# EAGLE design sensor_dsp (EAGLE 7.6.0)
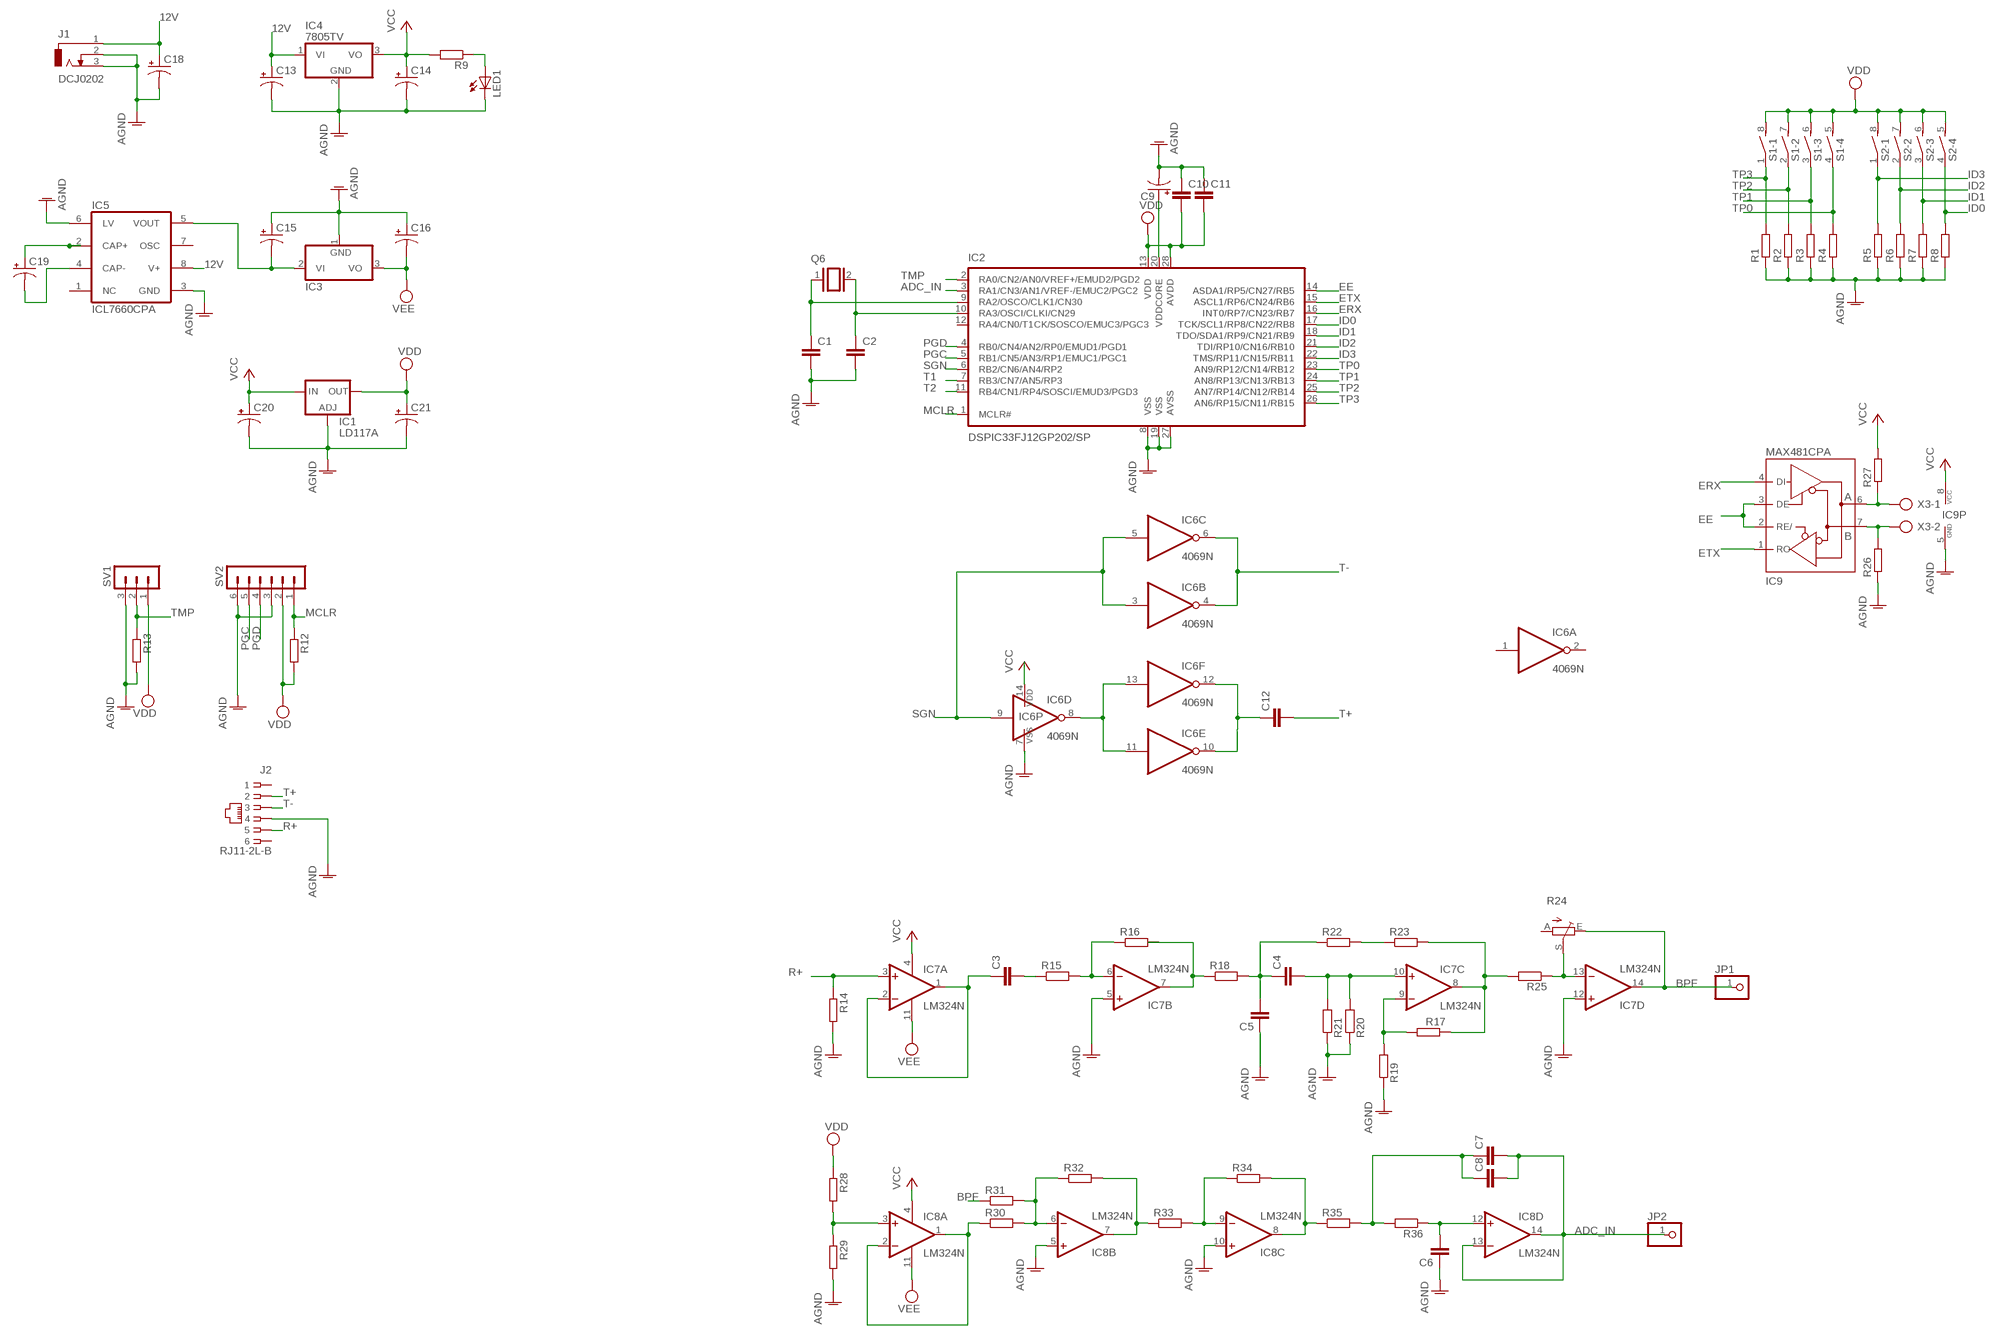
[diagram p0: schematic, sheet 1]

## Parts
C1  C2.5/2  [C2.5-2]
C2  C2.5/2  [C2.5-2]
C3  C2.5/2  [C2.5-2]
C4  C2.5/2  [C2.5-2]
C5  C-EU050-024X044  [C050-024X044]
C6  C-EU050-024X044  [C050-024X044]
C7  C2.5/2  [C2.5-2]
C8  C2.5/2  [C2.5-2]
C9  CPOL-USE3.5-8  [E3,5-8]
C10  C2.5/2  [C2.5-2]
C11  C2.5/2  [C2.5-2]
C12  C-EU050-024X044  [C050-024X044]
C13  CPOL-USE3.5-8  [E3,5-8]
C14  CPOL-USE3.5-8  [E3,5-8]
C15  CPOL-USE3.5-8  [E3,5-8]
C16  CPOL-USE3.5-8  [E3,5-8]
C18  CPOL-USE3.5-8  [E3,5-8]
C19  CPOL-USE3.5-8  [E3,5-8]
C20  CPOL-USE3.5-8  [E3,5-8]
C21  CPOL-USE3.5-8  [E3,5-8]
IC1  LD117A  [TO220S]
IC2  DSPIC33FJ12GP202/SP  [DIL28-3]
IC3  79  [TO220V]
IC4  7805TV  [TO220V]
IC5  ICL7660CPA  [DIL08]
IC6  4069N  [DIL14]
IC7  LM324N  [DIL14]
IC8  LM324N  [DIL14]
IC9  MAX481CPA  [DIL08]
J1  DCJ0202  [DCJ0202]
J2  RJ11-2L-B  [RJ11-NO_SHIELD]
JP1  PINHD-1X1  [1X01]
JP2  PINHD-1X1  [1X01]
LED1  LED3MM  [LED3MM]
Q6  XTAL/S  [QS]
R1  R-EU_0204/5  [0204/5]
R2  R-EU_0204/5  [0204/5]
R3  R-EU_0204/5  [0204/5]
R4  R-EU_0204/5  [0204/5]
R5  R-EU_0204/5  [0204/5]
R6  R-EU_0204/5  [0204/5]
R7  R-EU_0204/5  [0204/5]
R8  R-EU_0204/5  [0204/5]
R9  R-EU_0204/2V  [0204V]
R12  R-EU_0204/2V  [0204V]
R13  R-EU_0204/2V  [0204V]
R14  R-EU_0204/7  [0204/7]
R15  R-EU_0204/5  [0204/5]
R16  R-EU_0204/2V  [0204V]
R17  R-EU_0204/5  [0204/5]
R18  R-EU_0204/7  [0204/7]
R19  R-EU_0204/5  [0204/5]
R20  R-EU_0204/5  [0204/5]
R21  R-EU_0204/5  [0204/5]
R22  R-EU_0204/5  [0204/5]
R23  R-EU_0204/5  [0204/5]
R24  TRIM_EU-B64W  [B64W]
R25  R-EU_0204/5  [0204/5]
R26  R-EU_0204/5  [0204/5]
R27  R-EU_0204/5  [0204/5]
R28  R-EU_0204/5  [0204/5]
R29  R-EU_0204/5  [0204/5]
R30  R-EU_0204/7  [0204/7]
R31  R-EU_0204/7  [0204/7]
R32  R-EU_0204/2V  [0204V]
R33  R-EU_0204/7  [0204/7]
R34  R-EU_0204/2V  [0204V]
R35  R-EU_0204/7  [0204/7]
R36  R-EU_0204/5  [0204/5]
S1  DIP04S  [DIP04S]
S2  DIP04S  [DIP04S]
SV1  MA03-1  [MA03-1]
SV2  MA06-1  [MA06-1]
X3  AK300/2  [AK300/2]

## Nets
12V: C13.+ C18.+ IC4.1(VI) IC5.8(V+) J1.1
A: IC9.6(A) R27.1 X3.1
ADC_IN: C7.2 C8.2 IC2.3(RA1/CN3/AN1/VREF-/EMUC2/PGC2) IC8.13(D:-IN) IC8.14(D:OUT) JP2.1
AGND: C1.2 C2.2 C5.1 C6.1 C9.- C10.1 C11.1 C13.- C14.- C15.+ C16.+ C18.- C20.- C21.- IC1.1(ADJ) IC2.8(VSS) IC2.19(VSS) IC2.27(AVSS) IC3.1(GND) IC4.2(GND) IC5.3(GND) IC5.6(LV) IC6.7(P:VSS) IC7.5(B:+IN) IC7.12(D:+IN) IC8.5(B:+IN) IC8.10(C:+IN) IC9.5(GND) J1.2 J1.3 J2.4 LED1.K(C) R1.1 R2.1 R3.1 R4.1 R5.1 R6.1 R7.1 R8.1 R13.2 R14.2 R19.1 R20.1 R21.1 R26.1 R29.2 SV1.3 SV2.3 SV2.6
B: IC9.7(B) R26.2 X3.2
BPF: IC7.14(D:OUT) JP1.1 R24.E R31.1
EE: IC2.14(ASDA1/RP5/CN27/RB5) IC9.2(RE/) IC9.3(DE)
ERX: IC2.16(INT0/RP7/CN23/RB7) IC9.4(DI)
ETX: IC2.15(ASCL1/RP6/CN24/RB6) IC9.1(RO)
ID0: IC2.17(TCK/SCL1/RP8/CN22/RB8) R8.2 S2.4
ID1: IC2.18(TDO/SDA1/RP9/CN21/RB9) R7.2 S2.3
ID2: IC2.21(TDI/RP10/CN16/RB10) R6.2 S2.2
ID3: IC2.22(TMS/RP11/CN15/RB11) R5.2 S2.1
MCLR: IC2.1(MCLR#) R12.1 SV2.1
N$1: C9.+ IC2.20(VDDCORE)
N$2: C19.+ IC5.2(CAP+)
N$3: C15.- IC3.2(VI) IC5.5(VOUT)
N$4: C1.1 IC2.9(RA2/OSCO/CLK1/CN30) Q6.1
N$5: C19.- IC5.4(CAP-)
N$6: LED1.A R9.1
N$7: C3.1 IC7.1(A:OUT) IC7.2(A:-IN)
N$8: C2.1 IC2.10(RA3/OSCI/CLKI/CN29) Q6.2
N$9: IC7.6(B:-IN) R15.2 R16.1
N$12: IC6.8(D:O) IC6.11(E:I) IC6.13(F:I)
N$13: C12.1 IC6.10(E:O) IC6.12(F:O)
N$14: IC7.7(B:OUT) R16.2 R18.1
N$15: C3.2 R15.1
N$16: IC7.8(C:OUT) R17.1 R23.2 R25.2
N$17: IC7.9(C:-IN) R17.2 R19.2
N$18: C4.2 IC7.10(C:+IN) R20.2 R21.2
N$19: IC8.1(A:OUT) IC8.2(A:-IN) R30.1
N$20: C4.1 C5.2 R18.2 R22.1
N$21: R22.2 R23.1
N$22: IC7.13(D:-IN) R24.S R25.1
N$23: IC8.3(A:+IN) R28.2 R29.1
N$24: IC8.6(B:-IN) R30.2 R31.2 R32.1
N$25: IC8.7(B:OUT) R32.2 R33.1
N$26: IC8.9(C:-IN) R33.2 R34.1
N$27: IC8.8(C:OUT) R34.2 R35.1
N$29: C7.1 C8.1 R35.2 R36.2
N$30: C6.2 IC8.12(D:+IN) R36.1
PGC: IC2.5(RB1/CN5/AN3/RP1/EMUC1/PGC1) SV2.5
PGD: IC2.4(RB0/CN4/AN2/RP0/EMUD1/PGD1) SV2.4
R+: IC7.3(A:+IN) J2.5 R14.1
SGN: IC2.6(RB2/CN6/AN4/RP2) IC6.3(B:I) IC6.5(C:I) IC6.9(D:I)
T1: IC2.7(RB3/CN7/AN5/RP3)
T2: IC2.11(RB4/CN1/RP4/SOSCI/EMUD3/PGD3)
T+: C12.2 J2.2
T-: IC6.4(B:O) IC6.6(C:O) J2.3
TMP: IC2.2(RA0/CN2/AN0/VREF+/EMUD2/PGD2) R13.1 SV1.2
TP0: IC2.23(AN9/RP12/CN14/RB12) R4.2 S1.4
TP1: IC2.24(AN8/RP13/CN13/RB13) R3.2 S1.3
TP2: IC2.25(AN7/RP14/CN12/RB14) R2.2 S1.2
TP3: IC2.26(AN6/RP15/CN11/RB15) R1.2 S1.1
VCC: C14.+ C20.+ IC1.3(IN) IC4.3(VO) IC6.14(P:VDD) IC7.4(P:V+) IC8.4(P:V+) IC9.8(VCC) R9.2 R27.2
VDD: C10.2 C11.2 C21.+ IC1.2(OUT) IC2.13(VDD) IC2.28(AVDD) R12.2 R28.1 S1.5 S1.6 S1.7 S1.8 S2.5 S2.6 S2.7 S2.8 SV1.1 SV2.2
VEE: C16.- IC3.3(VO) IC7.11(P:V-) IC8.11(P:V-)
Unconnected: IC2.12(RA4/CN0/T1CK/SOSCO/EMUC3/PGC3) IC5.1(NC) IC5.7(OSC) IC6.1(A:I) IC6.2(A:O) J2.1 J2.6 R24.A

## Library data of the parts
C1-C4 C7 C8 C10 C11 = capacitor-wima:C: CAPACITOR naming: grid - package width
C5 C6 C12 = rcl:C-EU: CAPACITOR, European symbol
C9 C13-C16 C18-C21 = rcl:CPOL-US: POLARIZED CAPACITOR, American symbol
IC1 = v-reg:LD117A?*: Low drop fixed and adjustable positive voltage regulators 1 A Source: http://www.st.com/stonline/products/literature/ds/7194/ld1117axx.pdf
IC2 = microchip-dspic:DSPIC33FJ12GP202: dsPIC33 General DSC
IC3 = linear:79*: Negative VOLTAGE REGULATOR
IC4 = linear:78*: Positive VOLTAGE REGULATOR Source: http://cache.national.com/ds/LM/LM78L05.pdf http://www.fairchildsemi.com/ds/LM/LM7805.pdf
IC5 = maxim:ICL7660CPA: VOLTAGE CONVERTER; MF: INTERSIL; MPN: ICL7660CPA; OC_FARNELL: 1018170; OC_NEWARK: 06F7441
IC6 = 40xx:4069: Hex INVERTER
IC7 IC8 = linear:LM324: OP AMP
IC9 = maxim:MAX481CPA: RS485 TRANSEIVER; MPN: MAX481CPA+; OC_FARNELL: unknown; OC_NEWARK: 99K3445
J1 = con-jack:DCJ0202: DC POWER JACK Source: DCJ0202.pdf; OC_FARNELL: unknown; OC_NEWARK: unknown
J2 = con-tycoelectronics:RJ11: CORCOM Modular RJ Jacks No Shield Source: www.tycoelectronics.com .. ENG_DS_1654001_1099_RJ_L_0507.pdf; MF: TYCO ELECTRONICS; MPN: RJ11-2L-B; OC_FARNELL: unknown; OC_NEWARK: 83F4463
JP1 JP2 = pinhead:PINHD-1X1: PIN HEADER
LED1 = led:LED: LED OSRAM: - CHIPLED LG R971, LG N971, LY N971, LG Q971, LY Q971, LO R971, LY R971 LH N974, LH R974 LS Q976, LO Q976, LY Q976 LO Q996 - Hyper CHIPLED LW Q18S LB Q993, LB Q99A, LB R99A - SideLED LS A670, LO A670, LY A670, LG A670, LP A670 LB A673, LV A673, LT A673, LW A673 LH A674 LY A675 LS A676, LA A676, LO A676, LY A676, LW A676 LS A679, LY A679, LG A679 - Hyper Micro SIDELED® LS Y876, LA Y876, LO Y876, LY Y876 LT Y87S - SmartLED LW L88C, LW L88S LB L89C, LB L89S, LG L890 LS L89K, LO L89K, LY L89K LS L896, LA L896, LO L896, LY L896 - TOPLED LS T670, LO T670, LY T670, LG T670, LP T670 LSG T670, LSP T670, LSY T670, LOP T670, LYG T670 LG T671, LOG T671, LSG T671 LB T673, LV T673, LT T673, LW T673 LH T674 LS T676, LA T676, LO T676, LY T676, LB T676, LH T676, LSB T676, LW T676 LB T67C, LV T67C, LT T67C, LS T67K, LO T67K, LY T67K, LW E67C LS E67B, LA E67B, LO E67B, LY E67B, LB E67C, LV E67C, LT E67C LW T67C LS T679, LY T679, LG T679 LS T770, LO T770, LY T770, LG T770, LP T770 LB T773, LV T773, LT T773, LW T773 LH T774 LS E675, LA E675, LY E675, LS T675 LS T776, LA T776, LO T776, LY T776, LB T776 LHGB T686 LT T68C, LB T68C - Hyper Mini TOPLED® LB M676 - Mini TOPLED Santana® LG M470 LS M47K, LO M47K, LY M47K Source: http://www.osram.convergy.de LUXEON: - LUMILED® LXK2-PW12-R00, LXK2-PW12-S00, LXK2-PW14-U00, LXK2-PW14-V00 LXK2-PM12-R00, LXK2-PM12-S00, LXK2-PM14-U00 LXK2-PE12-Q00, LXK2-PE12-R00, LXK2-PE12-S00, LXK2-PE14-T00, LXK2-PE14-U00 LXK2-PB12-K00, LXK2-PB12-L00, LXK2-PB12-M00, LXK2-PB14-N00, LXK2-PB14-P00, LXK2-PB14-Q00 LXK2-PR12-L00, LXK2-PR12-M00, LXK2-PR14-Q00, LXK2-PR14-R00 LXK2-PD12-Q00, LXK2-PD12-R00, LXK2-PD12-S00 LXK2-PH12-R00, LXK2-PH12-S00 LXK2-PL12-P00, LXK2-PL12-Q00, LXK2-PL12-R00 Source: www.luxeon.com KINGBRIGHT: KA-3528ASYC Source: www.kingbright.com
Q6 = special:XTAL/S: CRYSTAL
R1-R9 R12-R17 R19-R23 R25-R36 = rcl:R-EU_: RESISTOR, European symbol
R18 = resistor:R-EU_: RESISTOR, European symbol
R24 = pot:TRIM_EU-: POTENTIOMETER
S1 S2 = switch-dil:DIP04S: DIL/CODE SWITCH; OC_FARNELL: unknown; OC_NEWARK: unknown
SV1 = con-lstb:MA03-1: PIN HEADER; OC_FARNELL: unknown; OC_NEWARK: unknown
SV2 = con-lstb:MA06-1: PIN HEADER; OC_FARNELL: unknown; OC_NEWARK: unknown
X3 = con-ptr500:AK300/2: CONNECTOR; OC_FARNELL: unknown; OC_NEWARK: unknown

## Board
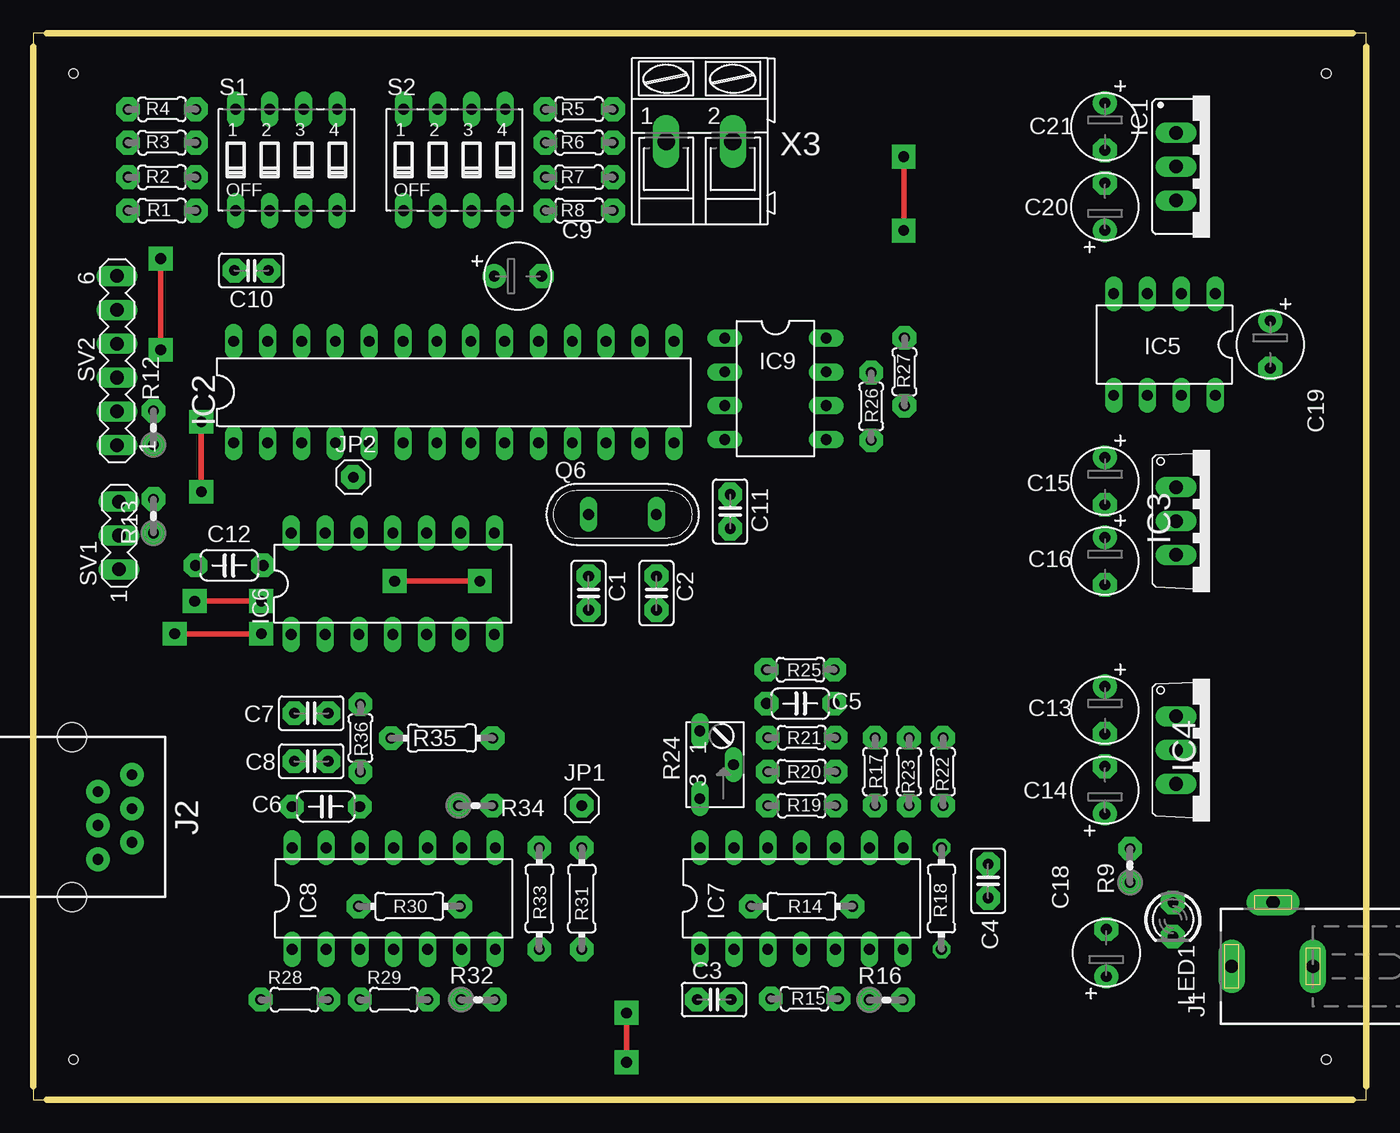
[diagram p1: board, top side]
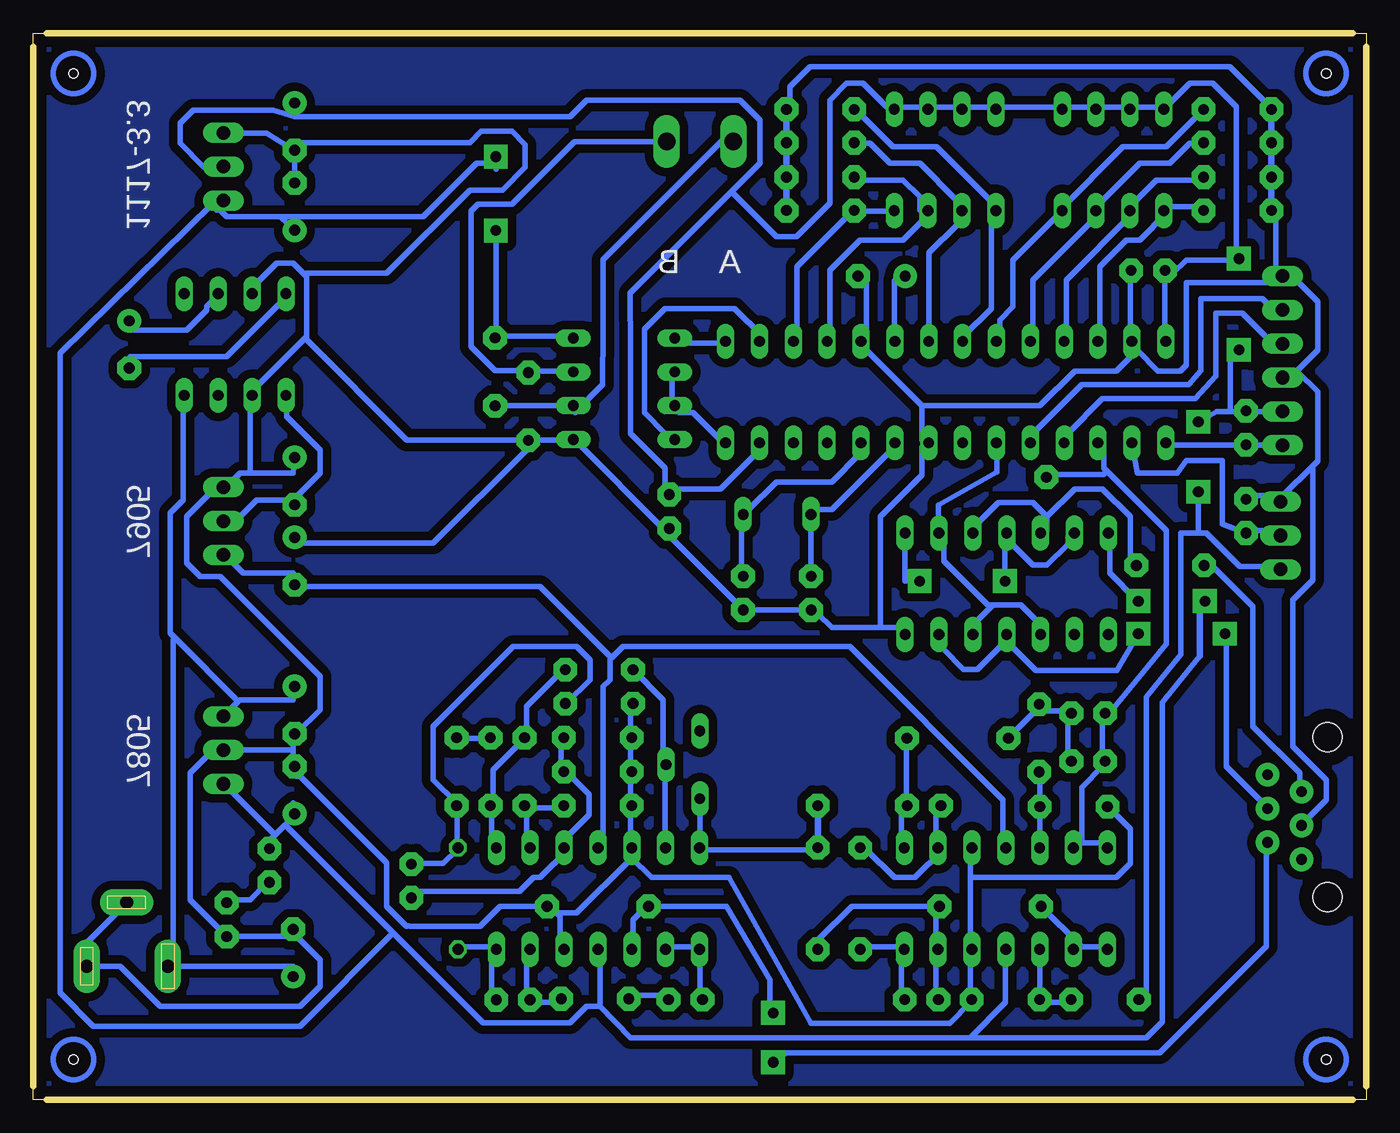
[diagram p2: board, bottom side, seen from below]

Size 100 x 80 mm. Coordinates in mm from the lower left corner, seen from the top.
Outline: 0,0 100,0 100,80 0,80 0,0
Copper layers (1*16): Top 0.035mm / dielectric 1.5mm / Bottom 0.035mm
Design rules "default *": minimum track width 16mil, minimum drill 24mil, track to track 25mil, track to pad 25mil, pad to pad 25mil, via to via 25mil, smd to smd 8mil, copper to edge 40mil, drill to drill 8mil, minimum pad ring 10mil, minimum via ring 8mil, stop-mask expansion 4mil, vias tented up to drill 0mil, thermal gap 10mil
Holes 0.7 mm at 3,77 97,77 97,3 3,3
Milling: 4 lines

### Footprints (pad centres in the part's own frame; a part is rotated, then mirrored left to right if it is on the bottom)
C2.5-2 = drill 0.8 pad 1.778 octagon: 1 -1.27,0; 2 1.27,0
C050-024X044 = drill 0.813 pad 1.778 octagon: 1 -2.54,0; 2 2.54,0
E3,5-8 = drill 0.813 pad 1.778: + -1.778,0 | drill 0.813 pad 1.778 octagon: - 1.778,0
TO220S = drill 1.016 long: 1 -2.54,-2.54; 2 0,-2.54; 3 2.54,-2.54
DIL28-3 = drill 0.813 long: 1 -16.51,-3.81; 2 -13.97,-3.81; 3 -11.43,-3.81; 4 -8.89,-3.81; 5 -6.35,-3.81; 6 -3.81,-3.81; 7 -1.27,-3.81; 8 1.27,-3.81; 9 3.81,-3.81; 10 6.35,-3.81; 11 8.89,-3.81; 12 11.43,-3.81; 13 13.97,-3.81; 14 16.51,-3.81; 15 16.51,3.81; 16 13.97,3.81; 17 11.43,3.81; 18 8.89,3.81; 19 6.35,3.81; 20 3.81,3.81; 21 1.27,3.81; 22 -1.27,3.81; 23 -3.81,3.81; 24 -6.35,3.81; 25 -8.89,3.81; 26 -11.43,3.81; 27 -13.97,3.81; 28 -16.51,3.81
TO220V = drill 1.016 long: 1 -2.54,-2.54; 2 0,-2.54; 3 2.54,-2.54
DIL08 = drill 0.813 long: 1 -3.81,-3.81; 2 -1.27,-3.81; 3 1.27,-3.81; 4 3.81,-3.81; 5 3.81,3.81; 6 1.27,3.81; 7 -1.27,3.81; 8 -3.81,3.81
DIL14 = drill 0.813 long: 1 -7.62,-3.81; 2 -5.08,-3.81; 3 -2.54,-3.81; 4 0,-3.81; 5 2.54,-3.81; 6 5.08,-3.81; 7 7.62,-3.81; 8 7.62,3.81; 9 5.08,3.81; 10 2.54,3.81; 11 0,3.81; 12 -2.54,3.81; 13 -5.08,3.81; 14 -7.62,3.81
DCJ0202 = drill 1 pad 2 long: 1 0,3.1; 2 4.8,0; 3 0,-3
RJ11-NO_SHIELD = drill 0.8 pad 1.778: 1 -3.175,8.89; 2 -1.905,6.35; 3 -0.635,8.89; 4 0.635,6.35; 5 1.905,8.89; 6 3.175,6.35 | hole 2.2: -6,4.4; 6,4.4
1X01 = drill 0.8 pad 1.778 octagon: 1 0,0
LED3MM = drill 0.8 pad 1.778 octagon: A -1.27,0; K 1.27,0
QS = drill 0.8 long: 1 -2.54,0; 2 2.54,0
0204/5 = drill 0.8 pad 1.778 octagon: 1 -2.54,0; 2 2.54,0
0204V = drill 0.8 pad 1.778 octagon: 1 -1.27,0; 2 1.27,0
0204/7 = drill 0.8 pad 1.778 octagon: 1 -3.81,0; 2 3.81,0
0204/7' = drill 0.813 octagon: 1 -3.81,0; 2 3.81,0
B64W = drill 0.813 long: A 2.54,0; E -2.54,0; S 0,-2.54
DIP04S = drill 0.813 long: 1 -3.81,-3.81; 2 -1.27,-3.81; 3 1.27,-3.81; 4 3.81,-3.81; 5 3.81,3.81; 6 1.27,3.81; 7 -1.27,3.81; 8 -3.81,3.81
MA03-1 = drill 1.016 long: 1 -2.54,0; 2 0,0; 3 2.54,0
MA06-1 = drill 1.016 long: 1 -6.35,0; 2 -3.81,0; 3 -1.27,0; 4 1.27,0; 5 3.81,0; 6 6.35,0
AK300/2 = drill 1.321 long: 1 -2.515,0; 2 2.489,0

### Placement (x,y rotation side)
C1  41.65,38 270 top
C2  46.75,38 270 top
C3  51.07,7.5 0 top
C4  71.64,16.4 270 top
C5  57.55,29.71 0 top
C6  21.95,21.98 0 top
C7  20.85,28.98 180 top
C8  20.85,25.38 180 top
C9  36.36,61.78 0 top
C10  16.36,62.2 180 top
C11  52.28,44.12 90 top
C12  14.7,40.08 180 top
C13  80.4,29.22 270 top
C14  80.4,23.22 90 top
C15  80.4,46.4 270 top
C16  80.4,40.4 270 top
C18  80.5,11 90 top
C19  92.8,56.65 270 top
C20  80.4,67 90 top
C21  80.4,73 270 top
IC1  88.28,70 270 top
IC2  31.55,53.08 0 top
IC3  88.28,43.4 270 top
IC4  88.28,26.22 270 top
IC5  84.86,56.65 180 top
IC6  26.97,38.7 0 top
IC7  57.64,15.08 0 top
IC8  27.04,15.08 0 top
IC9  55.68,53.33 270 top
J1  93,10 90 top
J2  -1.5,21.2 270 top
JP1  41.15,22.06 0 top
JP2  24,46.7 0 top
LED1  85.5,13.5 270 top
Q6  44.2,43.9 0 top
R1  9.65,66.7 0 top
R2  9.65,69.2 0 top
R3  9.65,71.8 0 top
R4  9.65,74.3 0 top
R5  40.95,74.3 180 top
R6  40.95,71.8 180 top
R7  40.95,69.2 180 top
R8  40.95,66.7 180 top
R9  82.28,17.56 90 top
R12  9.02,50.4 90 top
R13  9.02,43.78 90 top
R14  57.65,14.5 0 top
R15  57.86,7.56 0 top
R16  64,7.48 0 top
R17  63.15,24.6 270 top
R18  [0204/7']  68.14,15.08 90 top
R19  57.65,22.06 0 top
R20  57.65,24.61 0 top
R21  57.65,27.16 0 top
R22  68.25,24.6 90 top
R23  65.7,24.6 270 top
R24  50,25.12 90 top
R25  57.55,32.26 0 top
R26  62.86,52 90 top
R27  65.36,54.6 90 top
R28  19.6,7.5 0 top
R29  27.05,7.5 0 top
R30  28.21,14.5 0 top
R31  41.15,15.08 270 top
R32  33.36,7.5 0 top
R33  37.96,15.08 90 top
R34  33.18,22.06 0 top
R35  30.65,27.12 180 top
R36  24.54,27.12 90 top
S1  19,70.5 0 top
S2  31.6,70.5 0 top
SV1  6.43,42.32 90 top
SV2  6.28,55.44 90 top
X3  50,71.9 0 top

### Tracks (layer width: path | path; a pad name or v marks a point on that pad's centre or on a via)
12V
  Bottom 0.406: 89.5,10 J1.1 89.75,10 | 89.5,10 80.5,10 C18.+ | IC4.1 84.62,29.88 | 84.62,29.88 84.5,30 80.5,30 C13.+ | 84.62,29.88 89.38,34.62 | 89.38,34.62 89.75,35 89.75,44 88.75,45 88.75,52.75 IC5.8 | 89.5,10 89.5,34.5 89.38,34.62
A
  Bottom 0.406: R27.1 65.09,52.07 59.88,52.07 IC9.6 59.36,51.55 57.28,53.63 57.27,57.8 57.27,63.03 48.3,72 47.59,72 X3.1
ADC_IN
  Bottom 0.406: 21.35,19.27 21.87,19.27 IC8.13 21.35,19.27 | 21.35,19.27 19.79,19.27 IC8.14 | 19.27,29.16 C7.2 | C7.2 19.79,28.64 19.79,25.51 C8.2 19.79,24.99 21.35,23.43 21.35,19.27 | C7.2 19.5,28.7 15,34.2 15,42.7 16,43.7 19.35,47.05 19.45,47.15 | 19.45,47.15 19.69,47.38 19.69,48.95 IC2.3 | JP2.1 23.5,46.7 23.3,46.9 19.7,46.9 19.45,47.15
AGND
  Bottom 0.406: 33.33,52.07 33.33,49.47 IC2.8 33.33,48.95 33.33,46.86 36.45,43.74 36.45,35.41 | 33.33,52.07 38.01,56.76 IC2.19 37.49,57.28 37.49,61.44 C9.- | R26.1 62.48,49.47 59.88,49.47 IC9.5 59.36,49.47 52.59,42.7 C11.1 | 36.45,35.41 40.09,35.41 41.13,36.45 C1.2 | 36.45,35.41 34.89,35.41 IC6.7 | 41.66,36.97 C1.2 | 52.07,42.7 C11.1 | 46.86,36.97 C2.2 | R13.2 8.85,45.3 6.77,45.3 SV1.3 6.25,45.3 4.03,47.52 | IC2.27 17.7,57.28 17.7,61.44 C10.1 | 5.21,54.67 6.25,54.67 SV2.3 5.21,54.67 | 5.21,54.67 3.65,56.24 3.65,59.88 5.21,61.44 6.25,61.44 SV2.6 6.77,61.96 | 17.18,56.24 17.18,56.76 IC2.27 | 17.18,56.24 15.62,54.67 13.93,54.67 13.5,55.1 13.5,61.3 6.77,61.3 6.77,61.96 | 6.77,61.96 6.77,66.65 R1.1 | 4.03,47.52 3.65,47.9 3.65,53.11 5.21,54.67 | 33.33,52.07 24.47,52.07 21.87,54.67 18.75,54.67 17.18,56.24 | 17.18,56.24 IC2.27 | 29.68,16.66 29.68,11.46 IC8.5 29.68,10.94 29.68,7.81 R29.2 29.68,7.29 31.24,5.73 41.66,5.73 47.79,16.66 53.63,16.66 55.19,18.22 | 29.68,16.66 29.68,18.75 IC8.10 | 29.68,16.66 18.75,16.66 17.7,17.7 17.7,20.31 19.27,21.87 C6.1 | IC7.12 55.19,19.27 55.19,21.87 R19.1 55.19,22.39 55.19,24.47 R20.1 55.19,24.99 55.19,27.08 R21.1 55.19,27.6 55.19,29.68 C5.1 | 60.4,11.46 IC7.5 60.5,11.5 60.5,13.75 60.62,13.88 | 55.19,18.22 55.19,18.75 IC7.12 | 55.19,18.22 IC7.12 | R26.1 63.01,48.95 63,48.75 70,41.75 80.25,41.75 C16.+ | 63,49.25 R26.1 | J1.2 93,14.75 96,11.75 J1.3 93.5,10 90.5,7 80,7 78.5,8.5 78.5,10.5 80.5,12.5 | 80.5,26.25 80.5,27.75 C13.- | 80.5,26.25 80.5,24.5 C14.- 80.25,24.25 80,24.25 73.5,17.75 73.5,14.5 72,13 71.86,13.02 71.75,13 66.5,13 65,14.5 R14.2 61.25,14.5 60.62,13.88
  Bottom 0.406: 80.5,26.25 85.5,26.25 IC4.2 85.75,26 86.75,26 88.25,24.5 88.25,15 85.5,12.25 | 80.5,12.5 80.5,12.25 85.5,12.25 | 80.4,71.2 C20.- | 80.4,71.2 82.5,72.5 86.5,72.5 IC1.1 | 80.4,71.2 C21.- 80.5,71.8 67.25,71.8 66.4,72.65 64.1,72.65 63.1,71.65 63.1,69.95 64.8,68.25 67.25,68.25 73.5,62 79.5,62 79.62,61.88 | 83.75,47 84.5,47 85.5,46 IC3.1 85.75,45.75 86.5,45.75 88.5,43.75 88.5,40.25 87.5,39.25 86,39.25 78.5,31.75 78.5,29.25 80.25,27.5 C13.- | 83.75,47 80.5,47 C15.+ | 83.75,47 83.75,52.75 IC5.6 83.75,53 79.62,57.12 | 79.62,61.88 79.5,61.75 79.5,57.25 79.62,57.12 | 79.62,61.88 80.5,62.75 81.75,62.75 83.5,61 83.5,60.5 IC5.3 | 79.62,57.12 72,49.5 63,49.5 R26.1 | 80.25,28 C13.- | 85.5,12.25 LED1.K | R5.1 43.25,74.5 43.25,76 41.75,77.5 10.25,77.5 7.25,74.5 R4.1 | C1.2 41.75,36.75 46.75,36.75 C2.2 | 80.5,12.5 C18.- | 60.62,13.88 60.5,14 59.25,14 55.25,18 IC7.12 | C2.2 47,37 52.5,42.5 C11.1 | J2.4 4.5,21 3,22.5 3,24 5.5,26.5 5.5,37.5 4,39 4,47.5 4.03,47.52
  Bottom 0.5: R8.1 R7.1 R6.1 R5.1 | R1.1 R2.1 R3.1 R4.1
B
  Bottom 0.406: R26.2 62.48,54.67 59.88,54.67 IC9.7 | 63.01,54.67 R26.2 | X3.2 52.59,71.86 59.38,71.86 64.07,67.17 66.65,67.17 67.17,66.65 67.17,56.5 65.37,54.7 63.2,54.7 63.15,54.75 63,54.75 R26.2
BPF
  Bottom 0.406: R31.1 41.66,18.75 49.99,18.75 IC7.14 49.99,19.27 49.99,22.39 R24.E
  Bottom 0.5: JP1.1 R31.1
EE
  Bottom 0.406: IC2.14 48.42,49.47 50.51,51.55 51.55,51.55 IC9.3 52.07,52.07 52.07,54.15 IC9.2
ERX
  Bottom 0.406: IC9.4 52.07,49.99 52.59,49.99 54.15,51.55 54.15,57.8 52.59,59.36 47.38,59.36 45.3,57.28 IC2.16
ETX
  Bottom 0.406: IC2.15 48.42,56.76 51.55,56.76 IC9.1
ID0
  Bottom 0.406: S2.4 35.93,66.65 38.01,66.65 R8.2 38.53,66.65 42.7,62.48 42.7,57.28 IC2.17
ID1
  Bottom 0.406: R7.2 38.25,69 34.75,69 33.5,67.75 33.5,66.75 S2.3 32.75,66.5 34.75,64.5 38,64.5 40.25,62.25 40.25,57 IC2.18
ID2
  Bottom 0.406: IC2.21 32.8,57.28 32.8,63.52 30.72,65.61 30.72,66.65 S2.2 30.75,66.75 30.75,67.5 33.5,70.25 35.75,70.25 37.25,71.75 38.25,71.75 R6.2
ID3
  Bottom 0.406: IC2.22 30.2,57.28 28.12,59.36 28.12,66.65 S2.1 28.25,66.75 28.25,67.5 32.25,71.5 35.5,71.5 38.25,74.25 R5.2
MCLR
  Bottom 0.406: SV2.1 9.37,49.09 | 9.37,49.09 15.04,49.09 IC2.1 | R12.1 9.37,48.95 9.37,49.09
N$1
  Bottom 0.406: IC2.20 35.41,57.28 35.41,61.44 C9.+
N$2
  Bottom 0.406: IC5.2 86.25,60.25 87,59.5 87,59.25 88.5,57.75 92.75,57.75 C19.+
N$3
  Bottom 0.406: 80.5,45 83.25,45 84.75,43.5 85.5,43.5 IC3.2 | 80.5,45 78.5,47 78.5,48.75 81,51.25 81,52.75 IC5.5 | 80.5,45 C15.-
N$4
  Bottom 0.406: C1.1 41.66,39.57 41.66,43.74 Q6.1 41.66,44.26 40.09,44.26 35.41,48.95 IC2.9
N$5
  Bottom 0.406: C19.- 92.75,55.75 85.5,55.75 81,60.25 IC5.4
N$6
  Bottom 0.406: 82.5,16.75 R9.1 82.5,16.25 83.75,15 85.5,15 LED1.A
N$7
  Bottom 0.406: IC7.2 52.07,11.46 50.51,11.46 IC7.1 49.99,10.94 49.99,7.81 C3.1
N$8
  Bottom 0.406: C2.1 46.86,39.57 46.86,43.74 Q6.2 46.34,44.26 44.26,46.34 40.09,46.34 38.01,48.42 38.01,48.95 IC2.10
N$9
  Bottom 0.406: R15.2 60.4,7.29 62.48,7.29 R16.1 63.01,7.81 63.01,10.94 IC7.6
N$10
  pour Bottom: 0,80 100,80 100,0 0,0
N$12  (via drill 0.8 pad 1.78)
  Top 0.406: v27.1,38.9 v33.5,38.9
  Bottom 0.406: 27.08,42.18 24.99,40.09 23.95,40.09 22.39,41.66 22.39,42.18 IC6.13 | 27.08,42.18 IC6.11 | 27.08,42.18 27.1,42.18 v27.1,38.9 | v33.5,38.9 34.59,38.9 IC6.8
N$13
  Bottom 0.406: C12.1 17.7,40.09 17.7,43.74 19.79,45.82 21.87,45.82 23.95,43.74 | 23.95,43.74 23.95,42.7 IC6.12 | 23.95,43.74 24.99,44.78 27.6,44.78 29.16,43.22 29.16,42.7 IC6.10
N$14
  Bottom 0.406: R18.1 67.69,11.46 65.61,11.46 IC7.7 65.61,10.94 65.61,7.81 R16.2
N$15
  Bottom 0.406: R15.1 55.19,7.81 52.59,7.81 C3.2
N$16
  Bottom 0.406: IC7.8 65.61,19.27 65.61,21.87 R23.2 65.5,22.25 65.5,24.75 63.25,27 R17.1 63,27.25 63,29.5 60.25,32.25 R25.2
N$17
  Bottom 0.406: 63.01,21.87 63.01,19.27 IC7.9 | 63.01,21.87 60.4,21.87 R19.2 | 63.01,21.87 R17.2
N$18
  Bottom 0.406: R21.2 60.4,27.08 60.4,24.99 R20.2 59.88,24.47 58.32,22.91 58.32,21.35 59.88,19.79 59.88,19.27 IC7.10 59.88,18.75 61.96,16.66 62.48,16.66 63.52,15.62 71.34,15.62 C4.2
N$19
  Bottom 0.406: 21.35,11.46 21.87,11.46 IC8.2 21.35,11.46 | 21.35,11.46 19.79,11.46 IC8.1 | 21.35,11.46 24.47,14.58 R30.1
N$20
  Bottom 0.406: C4.1 71.34,17.7 69.25,17.7 68.21,18.75 R18.2 68.21,19.27 68.21,21.87 R22.1 68.25,22.25 70,24 70,28 64,34 59.25,34 58.25,33 58.25,31.5 60,29.75 C5.2
N$21
  Bottom 0.406: R23.1 66.13,27.08 68.21,27.08 R22.2
N$22
  Bottom 0.406: R24.S 52.59,24.99 52.59,19.27 IC7.13 | 54.67,31.76 R25.1 52.75,30 52.75,25.5 R24.S | 52.59,25.51 R24.S
N$23
  Bottom 0.406: R28.2 22.39,7.29 24.47,7.29 R29.1 24.47,7.81 24.47,10.94 IC8.3
N$24
  Bottom 0.406: R32.1 32.28,7.81 32.28,10.94 IC8.6 32.28,11.46 32.28,14.58 R30.2 38.6,14.5 41.13,11.96 41.13,11.46 R31.2
N$25
  Bottom 0.406: R32.2 34.89,7.81 34.89,10.94 IC8.7 34.89,11.46 37.49,11.46 R33.1
N$26
  Bottom 0.406: R34.1 32.28,21.87 32.28,19.27 IC8.9 31.76,18.75 33.85,16.66 35.41,16.66 37.49,18.75 R33.2
N$27
  Bottom 0.406: IC8.8 34.89,19.27 34.89,21.87 R34.2 34.5,22.25 34.5,27 R35.1
N$29
  Bottom 0.406: C8.1 22.39,25.51 22.39,28.64 C7.1 22.39,29.16 24.47,29.16 R36.2 24.5,29.5 26.75,27.25 R35.2
N$30
  Bottom 0.406: IC8.12 24.47,19.27 24.47,21.87 C6.2 24.47,22.39 24.47,24.47 R36.1
PGC
  Bottom 0.406: IC2.5 24.99,49.47 24.99,49.99 21.35,53.63 13.3,53.63 12.4,54.7 12.4,60.1 7.8,60.1 7.1,59.4 6.43,59.4 SV2.5
PGD
  Bottom 0.406: IC2.4 22.39,49.47 22.39,49.99 19.79,52.59 12.81,52.59 11.3,54.3 11.3,59 9.3,59 7.2,56.9 6.47,56.9 SV2.4
R+  (via drill 0.8 pad 1.78)
  Top 0.406: v44.5,6.5 v44.5,2.8
  Bottom 0.406: v44.5,2.8 43.5,3.5 15.5,3.5 7.5,11.5 7.5,19 J2.5 | IC7.3 55,11.5 55,13.5 54,14.5 R14.1 48,14.5 44.75,9 44.75,6.75 v44.5,6.5
SGN
  Bottom 0.406: IC2.6 27.7,48.1 27.7,47.1 32.1,44.6 IC6.9 | 28,37.1 25.9,37.1 24.5,35.7 24.5,35 IC6.3 | 32,42.5 IC6.9 | IC6.5 29.51,35.59 28,37.1 | 28,37.1 28.4,37.1 31.7,40.4 31.7,42.16 IC6.9
T+
  Bottom 0.406: J2.2 5,23.5 5,24.5 8.5,28 8.5,37 12,40.5 C12.2
T-  (via drill 0.8 pad 1.78)
  Top 0.406: v17.1,34.95 v10.6,34.95
  Bottom 0.406: 27.08,34.37 27.08,34.89 IC6.4 | 27.08,34.37 29.16,32.28 30.2,32.28 31.76,33.85 31.76,34.89 IC6.6 | 27.08,34.37 26.97,34.37 24.8,32.2 18.7,32.2 v17.1,34.95 | J2.3 7.5,22 10.5,25 10.5,34.5 v10.6,34.95
TMP
  Bottom 0.406: SV1.2 6.77,42.7 8.85,42.7 R13.1 10.8,43.2 10.8,47.94 13.5,47.94 14.18,47 17.18,47 IC2.2
TP0
  Bottom 0.406: R4.2 12.25,74.25 15,71.5 18.25,71.5 23,66.75 S1.4 26.5,63 26.5,59.5 27.5,58.5 27.5,57 IC2.23
TP1
  Bottom 0.406: R3.2 12.25,71.75 13.25,71.75 14.75,70.25 17,70.25 20.5,66.75 S1.3 20,66.5 25,61.5 25,57 IC2.24
TP2
  Bottom 0.406: R2.2 12.25,69 15.75,69 18,66.75 S1.2 17.5,66.5 22.5,61.5 22.5,57 IC2.25
TP3
  Bottom 0.406: R1.2 12.5,67 15,67 S1.1 15,66.5 17,64.5 18,64.5 20,62.5 20,57 IC2.26
VCC  (via drill 0.8 pad 1.78)
  Top 0.406: v17.1,37.4 v12.1,37.4 | v65.3,65.2 v65.3,70.75
  Bottom 0.406: 29.68,4.65 27.08,7.29 27.08,10.94 IC8.4 | 29.68,4.65 55.19,4.65 57.5,7 | IC9.8 59.88,57.28 65.09,57.28 R27.2 65.3,57.14 v65.3,65.2 | 19.4,42.51 IC6.14 19.25,42.5 19.25,39.5 17.25,37.5 v17.1,37.4 | 12.5,33.3 15.3,29.8 15.3,5.85 16.5,4.65 29.68,4.65 | v65.3,70.75 65.3,69.8 | 65.61,70.29 v65.3,70.75 | 81.5,66.25 85.5,66.25 86.5,67.25 | 86.5,67.25 IC1.3 | 81.5,66.25 70.75,66.25 66.75,70.25 65.75,70.25 v65.3,70.75 | 81.5,66.25 C20.+ | 81.88,19.88 82.25,19.5 R9.2 | 81.88,19.88 81.12,20.62 | 81.12,20.62 80.5,21.25 80.5,22.25 C14.+ | 81.88,19.88 85.5,23.5 IC4.3 | 73,12.5 66.25,5.75 59.75,5.75 58.5,7 57.5,7 | 73,12.5 81.12,20.62 | 86.25,66.75 IC1.3 | 57.5,7 57.5,11.25 IC7.4 | 73,12.5 80,5.5 95.5,5.5 98,8 98,56 86.5,67.25 | 86.5,67 IC1.3
  Bottom 0.5: 12.5,33.3 12.5,37 v12.1,37.4
VDD  (via drill 0.8 pad 1.78)
  Top 0.406: v9.55,56.25 v9.55,63.1 | v12.6,50.85 v12.6,45.6
  Bottom 0.406: IC2.13 45.82,48.95 45.82,48.42 48.42,45.82 52.07,45.82 C11.2 52.59,45.82 52.59,47.38 55.19,49.99 55.19,58.32 55.25,58.5 55.25,60.5 47.62,68.12 | S2.5 35.41,74.46 33.33,74.46 S2.6 32.8,74.46 30.72,74.46 S2.7 30.2,74.46 28.12,74.46 S2.8 27.6,74.46 22.91,74.46 S1.5 22.39,74.46 20.31,74.46 S1.6 19.79,74.46 18.22,74.46 S1.7 17.7,74.46 15.62,74.46 S1.8 | IC2.28 15.1,57.28 15.1,61.44 C10.2 | 14.58,61.96 C10.2 | 15.1,74.46 S1.8 | 35.93,74.46 S2.5 | 16.66,7.81 R28.1 16.5,7.5 16.5,30.2 13.9,33.4 13.9,42.5 12.6,42.5 | 12.6,42.5 12,42.5 9.5,40 6.5,40 SV1.1 | 46.4,74.4 45.5,73.5 45.5,70.25 47.62,68.12 | 46.4,74.4 46.75,74.75 | 46.4,74.4 46.44,74.46 46.96,74.98 58.5,74.98 59.75,73.75 80.4,73.75 | IC1.2 87.25,70 89,71.75 89,73.25 88,74.25 82,74.25 80.4,73.75 | 80.4,73.75 C21.+ | SV2.2 9.02,51.63 | 9.02,51.63 R12.2 | 9.02,51.63 10.2,51.63 | 10.2,51.63 11.2,51.63 v12.6,50.85 | v9.55,63.1 9.55,63.15 | v9.55,56.25 9.55,56.15 10.2,55.5 10.2,51.63 | C10.2 14.5,62 13.5,63 10,63 v9.55,63.1 | S1.8 13.25,76.25 11.5,76.25 9.75,74.5 9.75,63.25 v9.55,63.1 | 47.62,68.12 44.25,64.75 42.75,64.75 40.25,67.25 40.25,75 39,76.25 37.75,76.25 36,74.5 S2.5 | v12.6,45.6 12.6,42.5
VEE
  Bottom 0.406: C16.- 80.5,39.5 84.25,39.5 85.5,40.75 IC3.3 | 57.25,19.25 57.5,19 IC7.11 57.25,19.25 | IC8.11 27.25,19 27.25,22.5 38.75,34 55.75,34 56.62,33.12 | 80.25,38.5 C16.- | 57.25,19.25 57.25,31 56.75,31.5 56.75,33 56.62,33.12 | 56.62,33.12 62,38.5 80,38.5 C16.-
(copper drawn outside any net)
  shapes: Bottom circle x4

### Text on the board
bNames: 1117-3.3 | A | B | 7905 | 7805